# EAGLE design tiny (EAGLE 9.4.2)
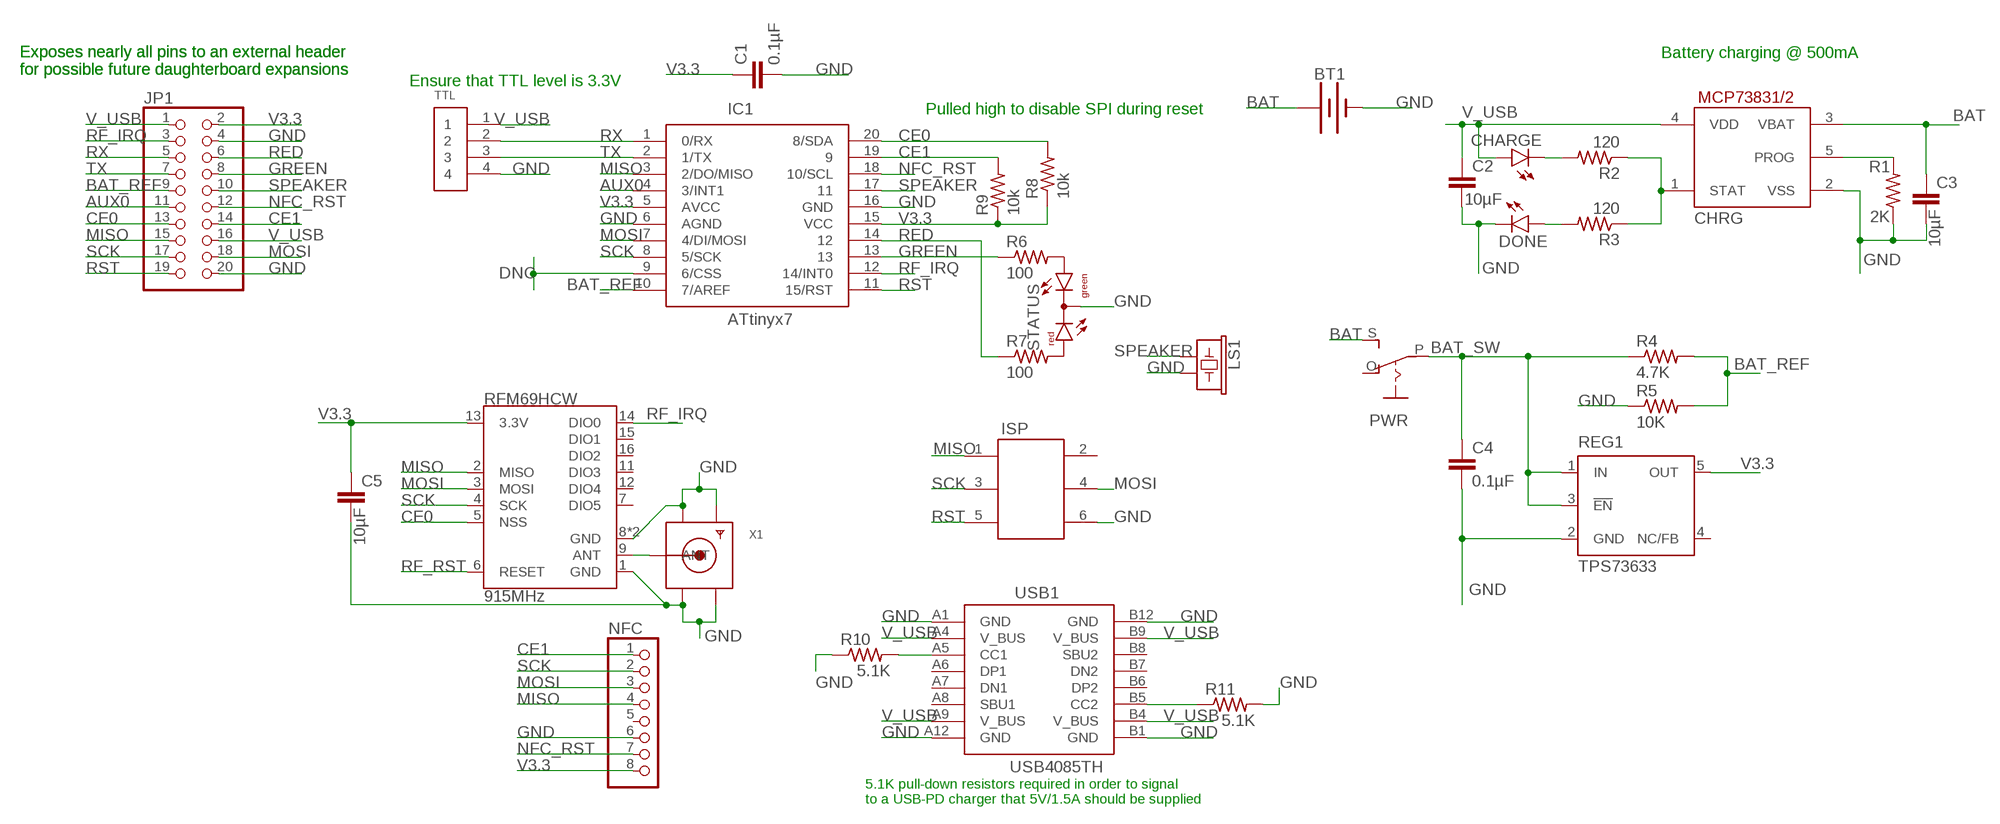
[diagram p0: schematic, sheet 1]

## Parts
BT1  BATTERY-18650  [BATTERY_18650-HOLDER]
C1  0.1µF  C-EU025-025X050  [C025-025X050]
C2  10µF  C-EU050-030X075  [C050-030X075]
C3  10µF  C-EU050-030X075  [C050-030X075]
C4  0.1µF  C-EU025-025X050  [C025-025X050]
C5  10µF  C-EU025-025X050  [C025-025X050]
CHARGE  LED3MM  [LED3MM]
CHRG  MCP73831/OT  [SOT23-5L]
DONE  LED3MM  [LED3MM]
IC1  ATtinyx7  ATTINY167  [SOIC127P1030X265-20N]
ISP  61200621621  [61200621621]
JP1  PINHD-2X10  [2X10]
LS1  Buzz Buzz  BUZZER-PTH  [BUZZER-12MM]
NFC  PINHD-1X8BIG  [1X08-BIG]
PWR  EG1218S  [EG1218]
R1  2K  R-US_0204/5  [0204/5]
R2  120  R-US_0204/5  [0204/5]
R3  120  R-US_0204/5  [0204/5]
R4  4.7K  R-US_0204/5  [0204/5]
R5  10K  R-US_0204/5  [0204/5]
R6  100  R-US_0204/5  [0204/5]
R7  100  R-US_0204/5  [0204/5]
R8  10k  R-US_0204/5  [0204/5]
R9  10k  R-US_0204/5  [0204/5]
R10  5.1K  R-US_0204/5  [0204/5]
R11  5.1K  R-US_0204/5  [0204/5]
REG1  TPS73633  TPS77001  [SOT23-DBV]
RFM69HCW  915MHz  RFM69HCW-433  [RFM69HCW-XXXS2]
STATUS  DUOLED-RG-C  [DUOLED-C-5MM]
TTL  1X4-BIG  [1X04-BIG]
USB1  USB4085TH  [USB4085]
X1  SMACONNECTOR_EDGE  [SMA_EDGELAUNCH]

## Nets
ANT: RFM69HCW.9(ANT) X1.P(ANT)
AUX0: IC1.4(3/INT1) JP1.11
BAT: BT1.PWR@1(+) BT1.PWR@2(+) BT1.PWR@3(+) C3.1 CHRG.3(VBAT) PWR.S
BAT_REF: IC1.10(7/AREF) JP1.9 R4.2 R5.2
BAT_SW: C4.1 PWR.P R4.1 REG1.1(IN) REG1.3(!EN)
CE0: IC1.20(8/SDA) JP1.13 R8.2 RFM69HCW.5(NSS)
CE1: IC1.19 JP1.14 NFC.1 R9.2
DNC: IC1.9(6/CSS)
GND: BT1.GND@1(-) BT1.GND@2(-) BT1.GND@3(-) C1.2 C2.2 C3.2 C4.2 C5.2 CHRG.2(VSS) DONE.K(C) IC1.6(AGND) IC1.16(GND) ISP.6 JP1.4 JP1.20 LS1.- NFC.6 R1.1 R5.1 R10.1 R11.2 REG1.2(GND) RFM69HCW.1(GND) RFM69HCW.8(GND) RFM69HCW.10(GND) STATUS.C TTL.4 USB1.A1(GND) USB1.A12(GND) USB1.B1(GND) USB1.B12(GND) X1.GND@1(GND4) X1.GND@2(GND3) X1.GND@3(GND2) X1.GND@4(GND1)
GREEN: IC1.13 JP1.8 R6.1
MISO: IC1.3(2/DO/MISO) ISP.1 JP1.15 NFC.4 RFM69HCW.2(MISO)
MOSI: IC1.7(4/DI/MOSI) ISP.4 JP1.18 NFC.3 RFM69HCW.3(MOSI)
N$1: DONE.A R3.2
N$2: CHRG.1(STAT) R2.1 R3.1
N$4: R6.2 STATUS.AX(AG)
N$5: R10.2 USB1.A5(CC1)
N$6: R11.1 USB1.B5(CC2)
N$7: CHARGE.K(C) R2.2
N$10: CHRG.5(PROG) R1.2
N$12: R7.2 STATUS.AR
NFC_RST: IC1.18(10/SCL) JP1.12 NFC.7
RED: IC1.14 JP1.6 R7.1
RF_IRQ: IC1.12(14/INT0) JP1.3 RFM69HCW.14(DIO0)
RF_RST: RFM69HCW.6(RESET)
RST: IC1.11(15/RST) ISP.5 JP1.19
RX: IC1.1(0/RX) JP1.5 TTL.2
SCK: IC1.8(5/SCK) ISP.3 JP1.17 NFC.2 RFM69HCW.4(SCK)
SPEAKER: IC1.17 JP1.10 LS1.+
TX: IC1.2(1/TX) JP1.7 TTL.3
V3.3: C1.1 C5.1 IC1.5(AVCC) IC1.15(VCC) JP1.2 NFC.8 R8.1 R9.1 REG1.5(OUT) RFM69HCW.13(3.3V)
V_USB: C2.1 CHARGE.A CHRG.4(VDD) JP1.1 JP1.16 TTL.1 USB1.A4(V_BUS) USB1.A9(V_BUS) USB1.B4(V_BUS) USB1.B9(V_BUS)
Unconnected: ISP.2 NFC.5 PWR.O REG1.4(NC/FB) RFM69HCW.7(DIO5) RFM69HCW.11(DIO3) RFM69HCW.12(DIO4) RFM69HCW.15(DIO1) RFM69HCW.16(DIO2) USB1.A6(DP1) USB1.A7(DN1) USB1.A8(SBU1) USB1.B6(DP2) USB1.B7(DN2) USB1.B8(SBU2)

## Notes on the sheet
- Battery charging @ 500mA
- Exposes nearly all pins to an external header
  for possible future daughterboard expansions
- Exposes nearly all pins to an external header
  for possible future daughterboard expansions
- Ensure that TTL level is 3.3V
- Pulled high to disable SPI during reset
- 5.1K pull-down resistors required in order to signal
  to a USB-PD charger that 5V/1.5A should be supplied

## Library data of the parts
BT1 = SparkFun-Batteries:BATTERY: Battery - Single Cell A variety of battery chemistries, sizes, and footprints. Device List: 20MM_PTH - Coin Cell Battery Holder - 20mm (PTH) <https://www.sparkfun.com/products/783> 6.8MM_PTH - Coin Cell Battery Holder - 6.8MM(SMD) <https://www.digikey.com/product-detail/en/seiko-instruments/MS621FE-FL11E/728-1057-ND/1889208?WT.srch=1&gclid=CNOQ5a6LzdQCFZS2wAodXCkE0g> 12MM_SMD - Coin Cell Battery Holder - 12mm (SMD) <https://www.sparkfun.com/products/10592> 12MM_PTH - Coin Cell Battery Holder - 12mm (PTH) <https://www.sparkfun.com/products/7948> 20MM_SMD - 20mm Coin Cell Battery Holder (SMD) (2 legs) Used on the Big Time Watch Kit <https://www.sparkfun.com/products/11734> 20MM_SMD_4LEGS - Coin Cell Battery Holder - 20mm (SMD) <https://www.sparkfun.com/products/11892> 20MM_SMD_4LEGS_OVERPASTE - Coin Cell Battery Holder - 20mm (SMD) <https://www.sparkfun.com/products/11892> (Over-paste on the legs) 24.5MM_PTH - Coin Cell Battery Holder - 24.5mm (PTH) <https://www.sparkfun.com/products/8863> 9V - 9V Battery Holder - PC Mount Used on the SparkFun SparkPunk Sound Kit <https://www.sparkfun.com/products/11177> and SparkFun SparkPunk Sequencer Kit <https://www.sparkfun.com/products/12707> 18650 - Battery Holder - 18650 (PTH) <https://www.sparkfun.com/products/13113> AA - Battery Holder - 1xAA (PTH) <https://www.sparkfun.com/products/7949> AAA - Battery Holder - 1xAAA (PTH) <https://www.sparkfun.com/products/12718> AA_KIT - Battery Holder - 1xAA (PTH) <https://www.sparkfun.com/products/7949> Special kit package - pads only have exposed copper on one side of the board. AAA_KIT - Battery Holder - 1xAAA (PTH) <https://www.sparkfun.com/products/12718> Special kit package - pads only have exposed copper on one side of the board.; PROD_ID: BATT-12327; SF_SKU: PRT-13113
C1-C5 = rcl:C-EU: CAPACITOR, European symbol; SPICEPREFIX: C
CHARGE DONE = led:LED: LED OSRAM: - CHIPLED LG R971, LG N971, LY N971, LG Q971, LY Q971, LO R971, LY R971 LH N974, LH R974 LS Q976, LO Q976, LY Q976 LO Q996 - Hyper CHIPLED LW Q18S LB Q993, LB Q99A, LB R99A - SideLED LS A670, LO A670, LY A670, LG A670, LP A670 LB A673, LV A673, LT A673, LW A673 LH A674 LY A675 LS A676, LA A676, LO A676, LY A676, LW A676 LS A679, LY A679, LG A679 - Hyper Micro SIDELED® LS Y876, LA Y876, LO Y876, LY Y876 LT Y87S - SmartLED LW L88C, LW L88S LB L89C, LB L89S, LG L890 LS L89K, LO L89K, LY L89K LS L896, LA L896, LO L896, LY L896 - TOPLED LS T670, LO T670, LY T670, LG T670, LP T670 LSG T670, LSP T670, LSY T670, LOP T670, LYG T670 LG T671, LOG T671, LSG T671 LB T673, LV T673, LT T673, LW T673 LH T674 LS T676, LA T676, LO T676, LY T676, LB T676, LH T676, LSB T676, LW T676 LB T67C, LV T67C, LT T67C, LS T67K, LO T67K, LY T67K, LW E67C LS E67B, LA E67B, LO E67B, LY E67B, LB E67C, LV E67C, LT E67C LW T67C LS T679, LY T679, LG T679 LS T770, LO T770, LY T770, LG T770, LP T770 LB T773, LV T773, LT T773, LW T773 LH T774 LS E675, LA E675, LY E675, LS T675 LS T776, LA T776, LO T776, LY T776, LB T776 LHGB T686 LT T68C, LB T68C - Hyper Mini TOPLED® LB M676 - Mini TOPLED Santana® LG M470 LS M47K, LO M47K, LY M47K Source: http://www.osram.convergy.de LUXEON: - LUMILED® LXK2-PW12-R00, LXK2-PW12-S00, LXK2-PW14-U00, LXK2-PW14-V00 LXK2-PM12-R00, LXK2-PM12-S00, LXK2-PM14-U00 LXK2-PE12-Q00, LXK2-PE12-R00, LXK2-PE12-S00, LXK2-PE14-T00, LXK2-PE14-U00 LXK2-PB12-K00, LXK2-PB12-L00, LXK2-PB12-M00, LXK2-PB14-N00, LXK2-PB14-P00, LXK2-PB14-Q00 LXK2-PR12-L00, LXK2-PR12-M00, LXK2-PR14-Q00, LXK2-PR14-R00 LXK2-PD12-Q00, LXK2-PD12-R00, LXK2-PD12-S00 LXK2-PH12-R00, LXK2-PH12-S00 LXK2-PL12-P00, LXK2-PL12-Q00, LXK2-PL12-R00 Source: www.luxeon.com KINGBRIGHT: KA-3528ASYC Source: www.kingbright.com
CHRG = adafruit:MCP73831: MCP73831/2 Miniature Single-Cell, Fully Integrated Li-Ion, Li-Polymer Charge Management Controllers. Nice and small simple lipoly charge controller, with adjustable current and status output (LED) http://www.ladyada.net/library/pcb/eaglelibrary.html
IC1 = SOIC127P1030X265-20N:ATTINY167
ISP = Wurth_Elektronik_Electromechanic_Wire_to_Board_Connectors_rev18a:61200621621: WR-BHD 2.54mm Male Box Header, 6 Pins=>Code : Con_WTB_BHD_2.54_Male_THT_WS_61200621621 <http://katalog.we-online.de/media/thumbs2/eican/thb_Con_WTB_BHD_2.54_Male_THT_WS_6120xx21621_pf2.jpg> Details see: http://katalog.we-online.de/en/em/612_0xx_216_21 Created 2014-06-04, Karrer Zheng 2014 (C) Würth Elektronik
JP1 = pinhead:PINHD-2X10: PIN HEADER
LS1 = SparkFun-Electromechanical:BUZZER: Buzzer Small round buzzers that operate around the audible 2kHz range. You can use these as speakers to create simple music or user interfaces. Variant Overview: PTH - Mini Speaker - PC Mount 12mm 2.048kHz <https://www.sparkfun.com/products/7950> PTH_KIT - Mini Speaker - PC Mount 12mm 2.048kHz <https://www.sparkfun.com/products/7950> KIT simplifies soldering by adding stop mask to one side of the pads. PTH_NO_SILK - Mini Speaker - PC Mount 12mm 2.048kHz <https://www.sparkfun.com/products/7950> No silkscreen indicator of buzzer outline. PTH_KIT_NO_SILK - Mini Speaker - PC Mount 12mm 2.048kHz <https://www.sparkfun.com/products/7950> KIT package w/o silkscreen SMD - Buzzer Audio Magnetic (CCV-084B16) SMD buzzer used on, e.g. the LilyPad Buzzer <https://www.sparkfun.com/products/8463> and RFID USB Reader <https://www.sparkfun.com/products/9963>. SMD_KIT - Buzzer Audio Magnetic (CCV-084B16) SMD Buzzer with elongated pins to make soldering easier. Used on the SparkFun Simon Says - Surface Mount Soldering Kit <https://www.sparkfun.com/products/10935>.; PROD_ID: COMP-08253; SF_SKU: COM-07950
NFC = adafruit:PINHD-1X8: PIN HEADER
PWR = adafruit:EG1218: SLIDING SWITCH 0.1" spacing through hole, vertical SPDT slide switch http://www.ladyada.net/library/pcb/eaglelibrary.html
R1-R11 = rcl:R-US_: RESISTOR, American symbol; SPICEPREFIX: R
REG1 = texas:TPS770*: ULTRALOW-POWER 50-mA LOW-DROPOUT LINEAR REGULATORS 50-mA Low-Dropout Regulator Source: http://focus.ti.com/lit/ds/symlink/tps77001.pdf; MF: TEXAS INSTRUMENTS; MPN: TPS77001DBVT; OC_FARNELL: 8461554; OC_NEWARK: 77C1171
RFM69HCW = SparkFun-RF:RFM69H: Hope RF RFM69H ISM Transceiver Module The RFM69H is a transceiver module capable of operation over a wide frequency range, including the 315,433,868 and 915MHz license-free ISM (Industry Scientific and Medical) frequency bands. All major RF communication parameters are programmable and most of them can be dynamically set. The RFM69H offers the unique advantage of programmable narrow-band and wide- band communication modes. The RFM69H is optimized for low power consumption while offering high RF output power and channelized operation.Compliance ETSI and FCC regulations. Datasheet <http://www.hoperf.cn/upload/docs/RF/SX/RFM69H_DataSheet_v1.3.pdf> SparkFun Products RFM69HCW Wireless Transceiver - 915MHz <https://www.sparkfun.com/products/13909> (COM-13909) RFM69HCW Wireless Transceiver - 434MHz <https://www.sparkfun.com/products/13910> (COM-13910) SparkFun RFM69 Breakout (915MHz) <https://www.sparkfun.com/products/12775> (WRL-12775) SparkFun RFM69 Breakout (434MHz) <https://www.sparkfun.com/products/12823> (WRL-12823); PROD_ID: IC-12053; VALUE: 433MHz
STATUS = led:DUOLED-RG-C: DUO LED 2 colors (red/green), 5 mm, round, common Cathode www.ligitek.com or other producers.
TTL = adafruit:1X4: 4-pin connector
USB1 = USB:USB4085: USB Type-C Connector (Through Hole)
X1 = adafruit:SMACONNECTOR: SMA Connector 90° DIP SMA Connector, 50 Ohm (4UConnector: 07259)

## Board
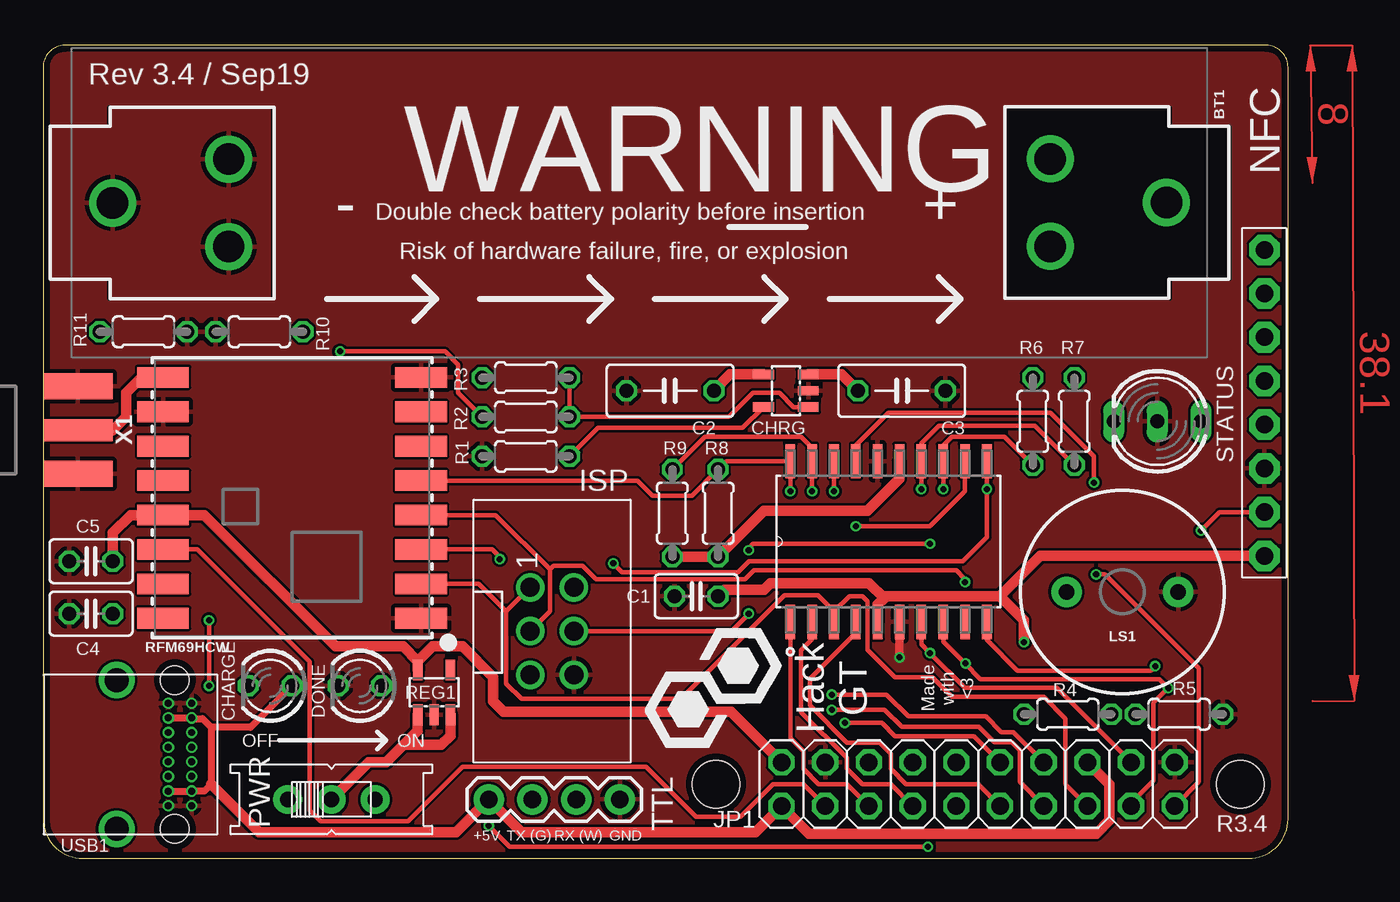
[diagram p1: board, top side]
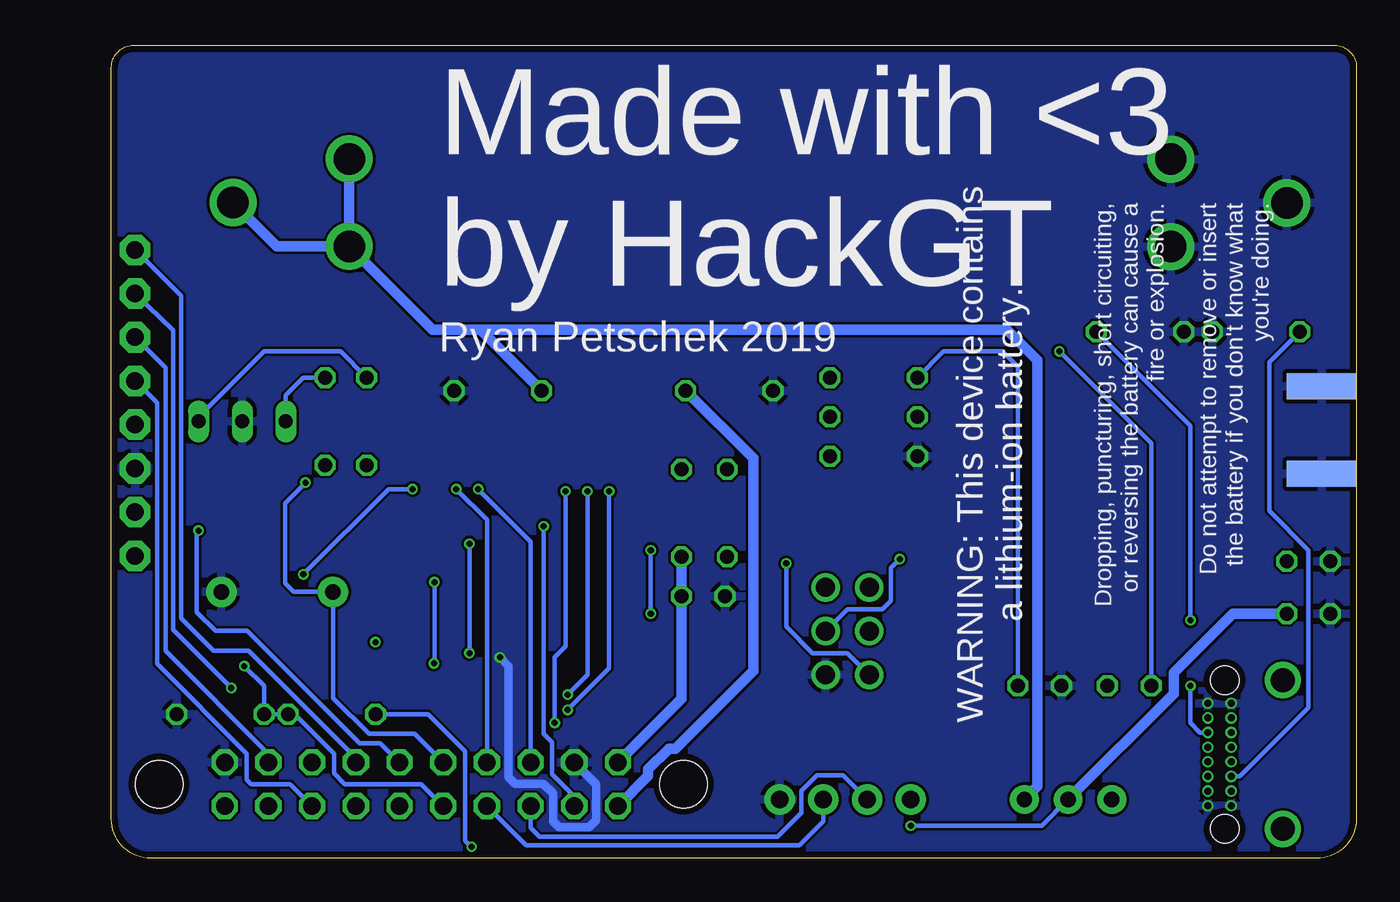
[diagram p2: board, bottom side, seen from below]

Size 72.37 x 47.24 mm. Coordinates in mm from the lower left corner, seen from the top.
Outline: 0,45.97 0,2.33 arc90 2.33,0 70.07,0 arc90 72.37,2.3 72.37,45.97 arc90 71.1,47.24 1.27,47.24 arc90 0,45.97
Copper layers (1*16): Top 0.035559375mm / dielectric 1.6mm / Bottom 0.035559375mm
Design rules "oshpark-2layer *": minimum track width 10mil, minimum drill 10mil, track to track 6mil, track to pad 6mil, pad to pad 6mil, via to via 6mil, smd to smd 6mil, copper to edge 15mil, drill to drill 6mil, minimum pad ring 5mil, minimum via ring 5mil, stop-mask expansion 2.5mil, vias tented up to drill 0mil, thermal gap 10mil
Holes 2.75 mm at 39.12,4.32 69.6,4.32

### Footprints (pad centres in the part's own frame; a part is rotated, then mirrored left to right if it is on the bottom)
BATTERY_18650-HOLDER = drill 1.829: GND@1 30.628,0.01; GND@2 23.88,2.55; GND@3 23.88,-2.53; PWR@1 -30.628,-0.01; PWR@2 -23.88,2.53; PWR@3 -23.88,-2.55
C025-025X050 = drill 0.813 octagon: 1 -1.27,0; 2 1.27,0
C050-030X075 = drill 0.813 octagon: 1 -2.54,0; 2 2.54,0
LED3MM = drill 0.813 octagon: A -1.27,0; K 1.27,0
SOT23-5L = smd 0.55 x 1.2: 1 -0.95,-1.3; 2 0,-1.3; 3 0.95,-1.3; 4 0.95,1.3; 5 -0.95,1.3
SOIC127P1030X265-20N = smd 1.981 x 0.559: 1 -4.674,5.715; 2 -4.674,4.445; 3 -4.674,3.175; 4 -4.674,1.905; 5 -4.674,0.635; 6 -4.674,-0.635; 7 -4.674,-1.905; 8 -4.674,-3.175; 9 -4.674,-4.445; 10 -4.674,-5.715; 11 4.674,-5.715; 12 4.674,-4.445; 13 4.674,-3.175; 14 4.674,-1.905; 15 4.674,-0.635; 16 4.674,0.635; 17 4.674,1.905; 18 4.674,3.175; 19 4.674,4.445; 20 4.674,5.715
61200621621 = drill 1.1: 1 -2.54,-1.27; 2 -2.54,1.27; 3 0,-1.27; 4 0,1.27; 5 2.54,-1.27; 6 2.54,1.27
2X10 = drill 1.016 octagon: 1 -11.43,-1.27; 2 -11.43,1.27; 3 -8.89,-1.27; 4 -8.89,1.27; 5 -6.35,-1.27; 6 -6.35,1.27; 7 -3.81,-1.27; 8 -3.81,1.27; 9 -1.27,-1.27; 10 -1.27,1.27; 11 1.27,-1.27; 12 1.27,1.27; 13 3.81,-1.27; 14 3.81,1.27; 15 6.35,-1.27; 16 6.35,1.27; 17 8.89,-1.27; 18 8.89,1.27; 19 11.43,-1.27; 20 11.43,1.27
BUZZER-12MM = drill 0.9 pad 1.778: + 3.25,0; - -3.25,0
1X08-BIG = drill 1.016 pad 1.778 octagon: 1 -8.89,0; 2 -6.35,0; 3 -3.81,0; 4 -1.27,0; 5 1.27,0; 6 3.81,0; 7 6.35,0; 8 8.89,0
EG1218 = drill 0.9 pad 1.676: O -2.54,0; P 0,0; S 2.54,0
0204/5 = drill 0.813 octagon: 1 -2.54,0; 2 2.54,0
SOT23-DBV = smd 0.55 x 1.2: 1 -0.95,-1.3; 2 0,-1.3; 3 0.95,-1.3; 4 0.95,1.3; 5 -0.95,1.3
RFM69HCW-XXXS2 = smd 3 x 1.2: 1 -7.5,7; 2 -7.5,5; 3 -7.5,3; 4 -7.5,1; 5 -7.5,-1; 6 -7.5,-3; 7 -7.5,-5; 8 -7.5,-7; 9 7.5,-7; 10 7.5,-5; 11 7.5,-3; 12 7.5,-1; 13 7.5,1; 14 7.5,3; 15 7.5,5; 16 7.5,7
DUOLED-C-5MM = drill 0.813 long: AR 2.54,0; AX -2.54,0; C 0,0
1X04-BIG = drill 1.016 pad 1.778: 1 0,0; 2 2.54,0; 3 5.08,0; 4 7.62,0
USB4085 = drill 0.4 pad 0.65: A1 0,0; A4 0.85,0; A5 1.7,0; A6 2.55,0; A7 3.4,0; A8 4.25,0; A9 5.1,0; A12 5.95,0; B1 5.95,-1.35; B4 5.1,-1.35; B5 4.25,-1.35; B6 3.4,-1.35; B7 2.55,-1.35; B8 1.7,-1.35; B9 0.85,-1.35; B12 0,-1.35 | drill 1.4 pad 1.8: S1 -1.35,-4.36; S2 7.3,-4.36 | hole 1.65: -1.35,-0.98; 7.3,-0.98
SMA_EDGELAUNCH = smd 4.064 x 1.524: GND@1 2.032,-2.54; GND@2 2.032,2.54 | smd 4.064 x 1.524 bottom: GND@3 2.032,2.54; GND@4 2.032,-2.54 | smd 4.064 x 1.27: P 2.032,0

### Placement (x,y rotation side)
BT1  34.67,38.1 180 top
C1  37.97,15.24 180 top
C2  36.45,27.18 180 top
C3  49.91,27.18 0 top
C4  2.79,14.22 180 top
C5  2.79,17.27 180 top
CHARGE  13.21,10.03 180 top
CHRG  43.18,27.18 90 top
DONE  18.41,10.03 180 top
IC1  49.15,18.41 90 top
ISP  29.59,13.21 270 top
JP1  54.36,4.32 0 top
LS1  62.74,15.49 180 top
NFC  70.99,26.48 270 top
PWR  16.76,3.43 0 top
R1  28.07,23.37 0 top
R2  28.07,25.65 180 top
R3  28.07,27.94 180 top
R4  59.56,8.38 0 top
R5  66.04,8.38 180 top
R6  57.53,25.4 90 top
R7  59.94,25.4 90 top
R8  39.24,20.07 90 top
R9  36.58,20.07 90 top
R10  12.57,30.61 0 top
R11  5.84,30.61 0 top
REG1  22.73,9.65 0 top
RFM69HCW  14.48,20.96 180 top
STATUS  64.77,25.4 180 top
TTL  25.91,3.43 0 top
USB1  8.64,9.02 270 top
X1  0,24.89 0 top

### Tracks (layer width: path | path; a pad name or v marks a point on that pad's centre or on a via)
ANT
  Top 0.61: RFM69HCW.9 5.73,27.96 4.83,27.05 4.83,25.65 4.06,24.89 X1.P
AUX0
  Top 0.254: JP1.11 54.36,4.32 50.16,4.32 49.28,5.21 49.28,6.1 48.64,6.73 46.74,6.73 44.58,8.89 44.58,10.44 47.24,13.11 IC1.4
BAT
  Top 0.61: CHRG.3 46.42,28.13 C3.1
  Bottom 0.61: BT1.PWR@3 BT1.PWR@2 | BT1.PWR@1 62.76,35.57 BT1.PWR@2 | BT1.PWR@2 53.71,30.73 50.93,30.73 | 50.93,30.73 20.32,30.73 18.54,28.96 18.54,4.19 PWR.S | C3.1 50.93,30.73
BAT_REF  (via drill 0.35)
  Top 0.254: IC1.10 54.86,12.7 56.64,10.92 64.39,10.92 v64.64,11.18
  Bottom 0.254: JP1.9 54.36,4.32 58.8,4.32 59.44,4.95 59.44,6.1 61.72,8.38 R4.2 R5.2 63.5,10.03 v64.64,11.18
BAT_SW  (via drill 0.35)
  Top 0.254: v51.44,0.68 27.13,0.68 v25.91,1.91
  Top 0.61: PWR.P 18.92,5.59 19.94,5.59 20.96,6.6 | 20.96,6.6 21.78,7.43 REG1.1 | REG1.3 23.68,7.15 23.14,6.6 20.96,6.6
  Bottom 0.254: R4.1 53.98,8.38 51.82,6.22 51.82,1.02 51.44,0.63 v51.44,0.68 | v25.91,1.91 18.29,1.91 PWR.P
  Bottom 0.61: PWR.P 10.62,9.58 10.62,10.78 7.18,14.22 C4.1
CE0  (via drill 0.35)
  Top 0.254: RFM69HCW.5 34.56,21.96 35.43,21.08 37.72,21.08 R8.2 39.73,23.09 IC1.20 v43.43,21.34 | JP1.13 56.77,4.44 56.77,6.3 56.31,6.76 55.29,6.76 54.4,7.65 49.91,7.65 48.92,8.64 v45.85,8.64
  Bottom 0.254: v43.43,21.34 43.43,11.05 v45.85,8.64
CE1  (via drill 0.35)
  Top 0.254: R9.2 38.48,24.51 44.07,24.51 44.7,23.88 IC1.19 v44.7,21.34 | JP1.14 56.41,7.34 55.71,7.34 54.8,8.26 50.29,8.26 49.02,9.53 v45.85,9.53
  Bottom 0.254: NFC.1 68.33,32.7 68.33,13.97 66.42,12.06 64.39,12.06 58.17,5.84 JP1.14 | v44.7,21.34 44.7,10.67 v45.85,9.53
GND  (via drill 0.35)
  Top 0.508: v49.78,11.68 IC1.6
  Bottom 0.508: JP1.4 44.2,4.32 44.2,2.21 44.6,1.8 46.35,1.8 46.71,2.16 46.71,3.79 47.27,4.34 48.89,4.34 49.28,4.72 49.28,11.18 v49.78,11.68
  pour Top: 0,48.51 72.39,48.51 72.39,-4.83 0,-4.83
  pour Bottom: 0,-6.1 0,49.78 72.39,49.78 72.39,-6.1
GREEN  (via drill 0.35)
  Top 0.254: R6.1 55.88,24.51 52.83,24.51 52.32,24 IC1.13 v52.32,21.46
  Bottom 0.254: v52.32,21.46 50.55,19.69 JP1.8
MISO
  Top 0.254: 45.97,14.35 45.03,15.29 43.1,15.29 37.08,9.27 27.81,9.27 26.92,10.16 26.92,14.35 | JP1.15 59.44,4.32 59.44,8.13 58.17,9.4 52.83,9.4 51.69,10.54 49.53,10.54 47.93,12.14 47.93,14.94 47.62,15.24 46.86,15.24 45.97,14.35 | 26.92,14.35 ISP.1 | RFM69HCW.2 25.32,15.96 26.92,14.35 | 45.97,14.35 IC1.3
  Bottom 0.254: JP1.15 61.98,4.32 64.26,4.32 64.52,4.57 64.52,6.1 69.72,11.3 69.72,26.48 NFC.4
MOSI  (via drill 0.35)
  Top 0.254: RFM69HCW.3 26.11,17.95 26.54,17.53 v26.54,17.4 | JP1.18 58.93,9.91 53.59,9.91 v51.56,11.94 51.05,12.45 IC1.7 | v51.56,18.29 41.27,18.29 41.02,18.03 v41.02,17.91 | v41.02,14.22 40.01,13.21 ISP.4
  Bottom 0.254: v51.56,11.94 v51.56,18.29 | v41.02,17.91 v41.02,14.22 | JP1.18 63.25,6.1 69.22,12.06 69.22,28.51 NFC.3 | v26.54,17.4 27.05,16.89 27.05,14.99 27.56,14.48 29.59,14.48 ISP.4
N$1
  Bottom 0.254: R3.2 24,29.46 20.57,29.46 19.69,28.58 DONE.A
N$2
  Top 0.254: CHRG.1 43.62,26.23 42.8,27.05 41.27,27.05 39.88,25.65 R2.1 R3.1
N$4
  Bottom 0.254: R6.2 59.05,29.46 63.5,29.46 67.31,25.65 STATUS.AX
N$5  (via drill 0.35)
  Top 0.254: v9.65,10.03 v9.65,13.84
  Bottom 0.254: USB1.A5 9.1,7.32 9.65,7.87 v9.65,10.03 | v9.65,13.84 9.65,25.15 R10.2
N$6
  Bottom 0.254: USB1.B5 6.79,4.77 2.79,8.76 2.79,17.91 5.08,20.19 5.08,28.83 R11.1
N$7  (via drill 0.35)
  Top 0.254: R2.2 24.13,27.05 24.13,28.7 23.37,29.46 v17.27,29.46
  Bottom 0.254: CHARGE.K 11.94,24.13 v17.27,29.46
N$10
  Top 0.254: CHRG.5 40.67,25.02 32.26,25.02 R1.2
N$12
  Bottom 0.254: STATUS.AR 62.23,26.92 61.21,27.94 R7.2
NFC_RST  (via drill 0.35)
  Top 0.254: IC1.18 v45.97,21.34 | JP1.12 54.1,7.11 49.53,7.11 48.77,7.87 v46.61,7.87 | v67.31,19.05 68.39,20.13 NFC.7
  Bottom 0.254: v46.61,7.87 46.61,11.68 45.97,12.32 v45.97,21.34 | JP1.12 56.74,6.71 57.95,6.71 64.49,13.24 66.32,13.24 67.41,14.32 67.41,18.95 v67.31,19.05
RED  (via drill 0.35)
  Top 0.254: R7.1 57.66,25.15 52.07,25.15 51.05,24.13 IC1.14 v51.05,21.46
  Bottom 0.254: JP1.6 48.01,18.41 v51.05,21.46
RF_IRQ  (via drill 0.35)
  Top 0.254: IC1.12 53.59,21.34 51.56,19.3 v47.24,19.3 | JP1.3 44.2,4.32 42.42,4.32 40.54,2.44 37.95,2.44 35.05,5.33 24.38,5.33 21.21,2.16 16.13,2.16 15.49,2.79 15.49,11.43 8.97,17.95 RFM69HCW.14
  Bottom 0.254: v47.24,19.3 47.24,7.24 46.76,6.76 46.76,4.9 45.47,3.61 JP1.3
RST  (via drill 0.35)
  Top 0.254: JP1.19 67.18,4.44 67.18,11.05 61.72,16.51 v61.21,16.51 | IC1.11 v54.86,21.46 54.86,18.67 53.47,17.27 41.02,17.27 40.39,16.64 33.66,16.64 v33.15,17.15
  Bottom 0.254: v61.21,16.51 56.26,21.46 v54.86,21.46 | ISP.5 29.59,11.94 31.62,11.94 33.15,13.46 v33.15,17.15
RX
  Top 0.254: IC1.1 43.43,6.99 44.2,6.22 44.2,5.21 45.09,4.32 46.74,4.32 JP1.5
  Bottom 0.254: JP1.5 48.01,1.78 47.5,1.27 33.66,1.27 32.26,2.67 32.26,3.94 31.37,4.83 29.84,4.83 TTL.2
SCK  (via drill 0.35)
  Top 0.254: RFM69HCW.4 26.31,19.96 29.46,16.8 | JP1.17 63.25,3.23 64.54,4.52 64.54,9.04 v65.41,9.91 64.9,10.41 54.49,10.41 53.57,11.33 | IC1.8 52.32,12.58 53.57,11.33 | v53.59,16.06 53.59,16.23 53.09,16.74 41.32,16.74 40.81,16.23 32.16,16.23 31.37,17.02 29.68,17.02 29.46,16.8 | v53.62,11.33 53.57,11.33 | ISP.3 29.46,14.35 29.46,16.8
  Bottom 0.254: NFC.2 68.78,30.69 68.78,13.28 v65.41,9.91 | v53.59,16.06 53.59,11.3 v53.62,11.33
SPEAKER  (via drill 0.35)
  Top 0.254: IC1.17 47.24,24 49.15,25.91 58.55,25.91 61.09,23.37 v61.09,21.84
  Bottom 0.254: JP1.10 54.74,7.24 57.4,7.24 59.49,9.32 LS1.+ 61.77,15.49 62.28,16 62.28,20.65 v61.09,21.84
TX
  Top 0.254: IC1.2 44.7,12.72 44.07,12.09 44.07,8.51 46.74,5.84 46.74,5.21 47.62,4.32 49.28,4.32 JP1.7
  Bottom 0.254: JP1.7 48.26,0.76 32.38,0.76 30.99,2.16 TTL.3
V3.3  (via drill 0.35)
  Top 0.61: R9.1 R8.1 41.91,20.19 47.92,20.19 49.78,22.06 IC1.15 | C1.1 39.62,15.62 41.91,15.62 42.29,16 48.01,16 48.89,15.11 | JP1.2 39.98,8.54 26.77,8.54 26.16,9.14 26.16,10.54 24.38,12.32 22.64,12.32 21.78,11.46 | IC1.5 48.51,14.73 48.89,15.11 | 48.89,15.11 49.02,15.24 55.63,15.24 | NFC.8 57.97,17.59 55.63,15.24 | v57.02,12.57 57.02,13.84 55.63,15.24 | 21.78,11.46 20.92,12.32 17.02,12.32 9.38,19.96 RFM69HCW.13 5.1,19.96 4.06,18.92 C5.1 | REG1.5 21.78,11.46
  Bottom 0.61: R8.1 C1.1 39.24,9.27 JP1.2
V_USB
  Top 0.406: USB1.B9 USB1.A4 8.68,8.13 9.27,8.13 9.78,7.62 | USB1.B4 USB1.A9 9.38,3.92 9.78,4.32 9.78,7.62 | CHARGE.A 12.07,7.62 9.78,7.62
  Top 0.61: 9.78,4.32 12.57,1.52 24,1.52 TTL.1 27.81,1.52 41.4,1.52 JP1.1 44.53,1.45 61.21,1.45 61.98,2.21 61.98,4.32 JP1.16 | C2.1 39.94,28.13 CHRG.4
  Bottom 0.61: C2.1 35.05,23.24 35.05,10.92 39.59,6.38 39.97,6.38 41.18,5.17 41.18,4.8 JP1.1
(copper drawn outside any net)
  shapes: Top area x2

### Text on the board
tPlace: Hack / GT | Made / with / <3 | OFF | ON
bPlace: Dropping, puncturing, short circuiting, / or reversing the battery can cause a / fire or explosion. / / Do not attempt to remove or insert / the battery if you don't know what / you're doing. | Made with <3 / by HackGT | Ryan Petschek 2019 | WARNING: This device contains / a lithium-ion battery.
tNames: Rev 3.4 / Sep19 | NFC | WARNING | Double check battery polarity before insertion | Risk of hardware failure, fire, or explosion | R3.4 | +5V | TX (G) | RX (W) | GND
tValues: R | G | Buzz Buzz | + | +